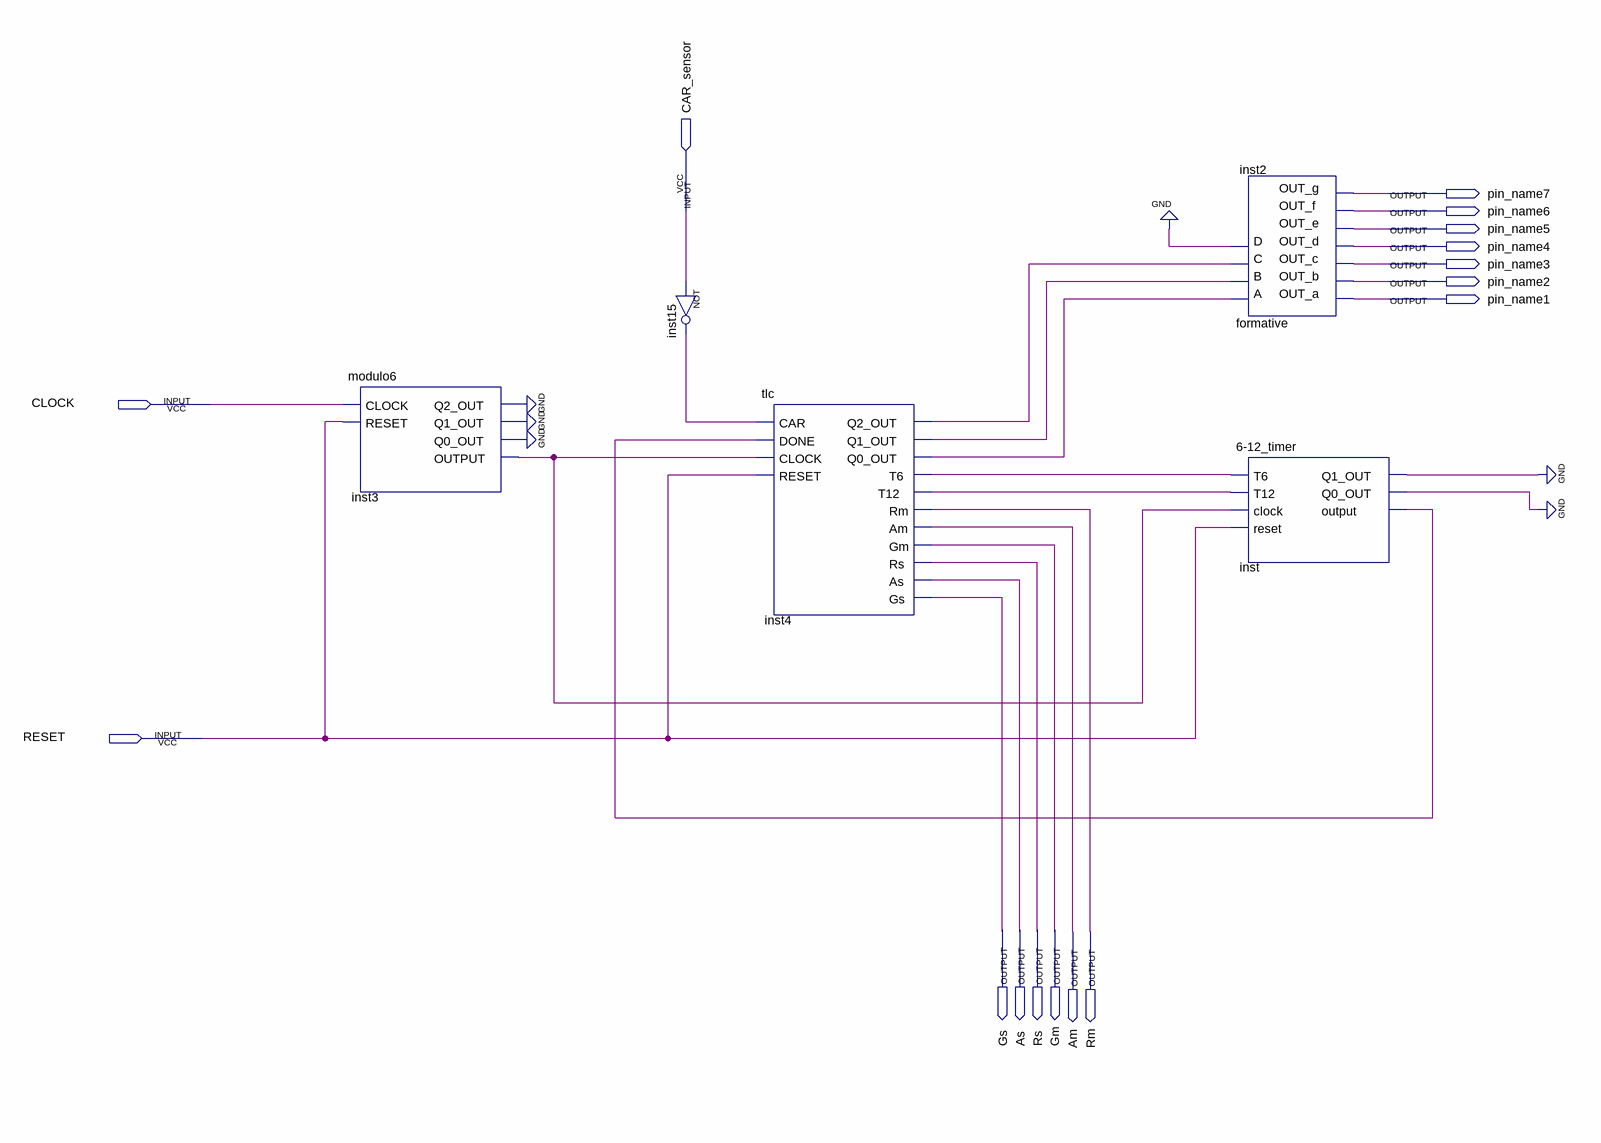
[diagram p0: schematic sheet]
// Quartus schematic TLC_FINAL.bdf as structural Verilog: 5 symbols, 16 pins
module TLC_FINAL (
  input  CAR_sensor,
  input  CLOCK,
  input  RESET,
  output pin_name7,
  output pin_name6,
  output pin_name5,
  output pin_name4,
  output pin_name3,
  output pin_name2,
  output pin_name1,
  output Gs,
  output As,
  output Rs,
  output Gm,
  output Am,
  output Rm
);

  wire inst3_output, inst3_q0_out, inst3_q1_out, inst3_q2_out, inst4_q0_out, inst4_q1_out, inst4_q2_out,
       inst4_t6, inst4_t12, inst15_out, inst_output, inst_q0_out, inst_q1_out;

  modulo6 inst3 (
    .CLOCK(CLOCK), .RESET(RESET), .Q2_OUT(inst3_q2_out), .Q1_OUT(inst3_q1_out), .Q0_OUT(inst3_q0_out),
    .OUTPUT(inst3_output));
  not inst15 (inst15_out, CAR_sensor);
  tlc inst4 (
    .CAR(inst15_out), .DONE(inst_output), .CLOCK(inst3_output), .RESET(RESET), .Q2_OUT(inst4_q2_out),
    .Q1_OUT(inst4_q1_out), .Q0_OUT(inst4_q0_out), .T6(inst4_t6), .T12(inst4_t12), .Rm(Rm), .Am(Am), .Gm(Gm),
    .Rs(Rs), .As(As), .Gs(Gs));
  formative inst2 (
    .A(inst4_q0_out), .B(inst4_q1_out), .C(inst4_q2_out), .D(1'b0), .OUT_a(pin_name1), .OUT_b(pin_name2),
    .OUT_c(pin_name3), .OUT_d(pin_name4), .OUT_e(pin_name5), .OUT_f(pin_name6), .OUT_g(pin_name7));
  \6-12_timer  inst (
    .T6(inst4_t6), .T12(inst4_t12), .clock(inst3_output), .reset(RESET), .Q1_OUT(inst_q1_out),
    .Q0_OUT(inst_q0_out), .\output (inst_output));
  // also tied to GND on the sheet: {inst_q0_out, inst_q1_out, inst3_q2_out, inst3_q1_out, inst3_q0_out}
endmodule
